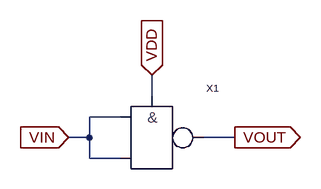
[diagram p0: schematic inverter_nand2.asc]
inverter_nand2.asc, the LTspice schematic file:
Version 4.1
SHEET 1 880 680
WIRE 224 112 224 80
WIRE 176 144 128 144
WIRE 128 176 128 144
WIRE 128 176 96 176
WIRE 352 176 304 176
WIRE 128 208 128 176
WIRE 176 208 128 208
FLAG 352 176 VOUT
IOPIN 352 176 Out
FLAG 96 176 VIN
IOPIN 96 176 In
FLAG 224 80 VDD
IOPIN 224 80 In
SYMBOL nand2 224 176 R0
SYMATTR InstName X1

The netlist it stands for:
* inverter_nand2.asc
X§X1 VDD VIN VIN VOUT nand2  ; pins VDD A B Y
.backanno
.end